# Altium schematic sheet PressureSensor.SchDoc
size A4; SheetNumber: 1; SheetTotal: 1
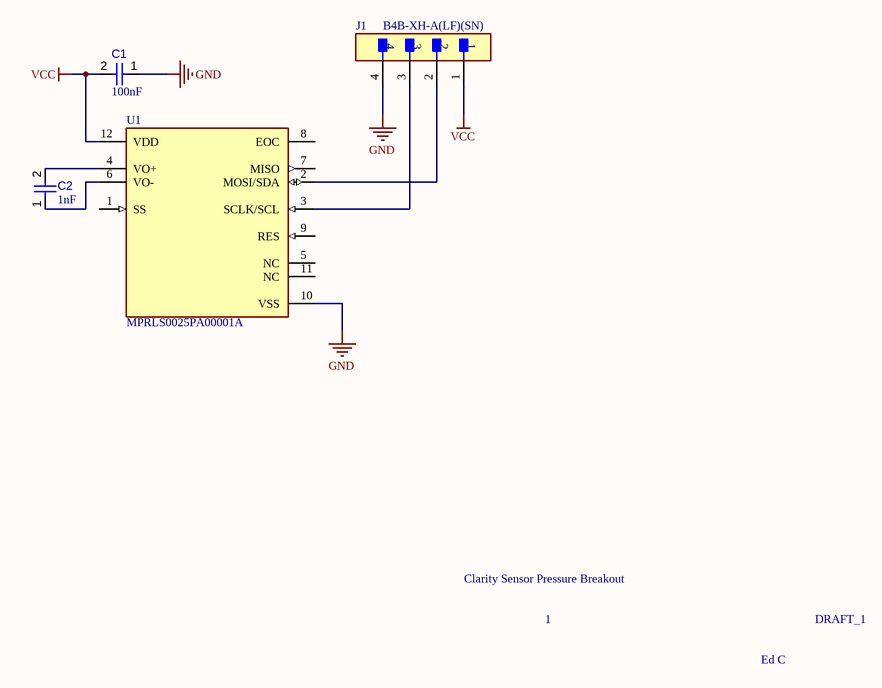
[diagram p0: PressureSensor.SchDoc]

## Parts
C1  value 100nF  [CAPC1608X90X40NL10T20]  (hidden comment: Capacitor 100 nF +/-10% 50 V 0603)
C2  value 1nF  [FP-0603-L_1_6_0_15-W_0_81-IPC_C]  (hidden comment: 06035C102KAT2A)
J1  B4B-XH-A(LF)(SN)  [FP-B4B-XH-A_LF_SN-MFG]
U1  MPRLS0025PA00001A  [FP-MPRLS0025PA00001A-MFG]

## Nets
GND: C1.1 J1.4 U1.10(VSS)
VCC: C1.2 J1.1 U1.12(VDD)
NetC2_1: C2.1 U1.6(VO-)
NetC2_2: C2.2 U1.4(VO+)
NetJ1_2: J1.2 U1.2(MOSI/SDA)
NetJ1_3: J1.3 U1.3(SCLK/SCL)

Not connected (* = marked no-connect by the designer): U1 1(SS) 5(NC) 7(MISO) 8(EOC) 9(RES) 11(NC)

## Notes on the sheet
- Clarity Sensor Pressure Breakout
- 1
- DRAFT_1
- Ed C

## Library data of the parts
C1 = CMP-001-00017-6: Chip Capacitor, 100 nF, +/- 10%, 50 V, 0603 (1608 Metric); Voltage Rating: 50V; Capacitor Type: Ceramic; Tolerance: 10%; Mounting Technology: SM; Max Operating Temperature: 125°C; RoHS Compliant: True; Pins: 2; Case/Package: 0603; Min Operating Temperature: -55°C
C2 = CMP-001-00083-1: Ceramic Capacitor, Multilayer, Ceramic, 50V, 10% +Tol, 10% -Tol, X7R, 15% TC, 0.001uF, Surface Mount, 0603; Capacitor Type: Ceramic; Pins: 2; Min Operating Temperature: -55°C; Max Operating Temperature: 125°C; Case/Package: 0603; RoHS Compliant: Yes; Mounting Technology: Surface Mount
J1 = CMP-002-00071-1: Header for PCB; pitch 2.50mm; 4-contacts; THT male; top entry; 250V/3A
U1 = CMP-010-00024-1: Absolute, 0Psi Min, 25Psi Max, 0.25%, 0.20-0.80V, Square, Board Mount; Sensor Type: PRESSURE SENSOR,PEIZORESISTIVE; RoHS Compliant: Yes